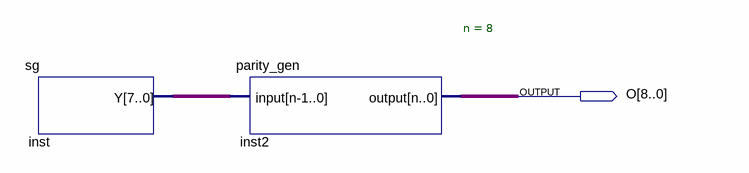
[diagram p0: schematic sheet]
// Quartus schematic tb_top.bdf as structural Verilog: 2 symbols, 1 pins
module tb_top (
  output [8:0] O
);

  wire [7:0] inst_y;

  sg inst (.Y(inst_y));
  parity_gen #(.n(8)) inst2 (.\input (inst_y), .\output (O));
endmodule
